# EAGLE design thick_ (EAGLE 9.6.2)
CNAME: Thicker PCB; CREVISION: 1; DESIGNER: Székely Flórián
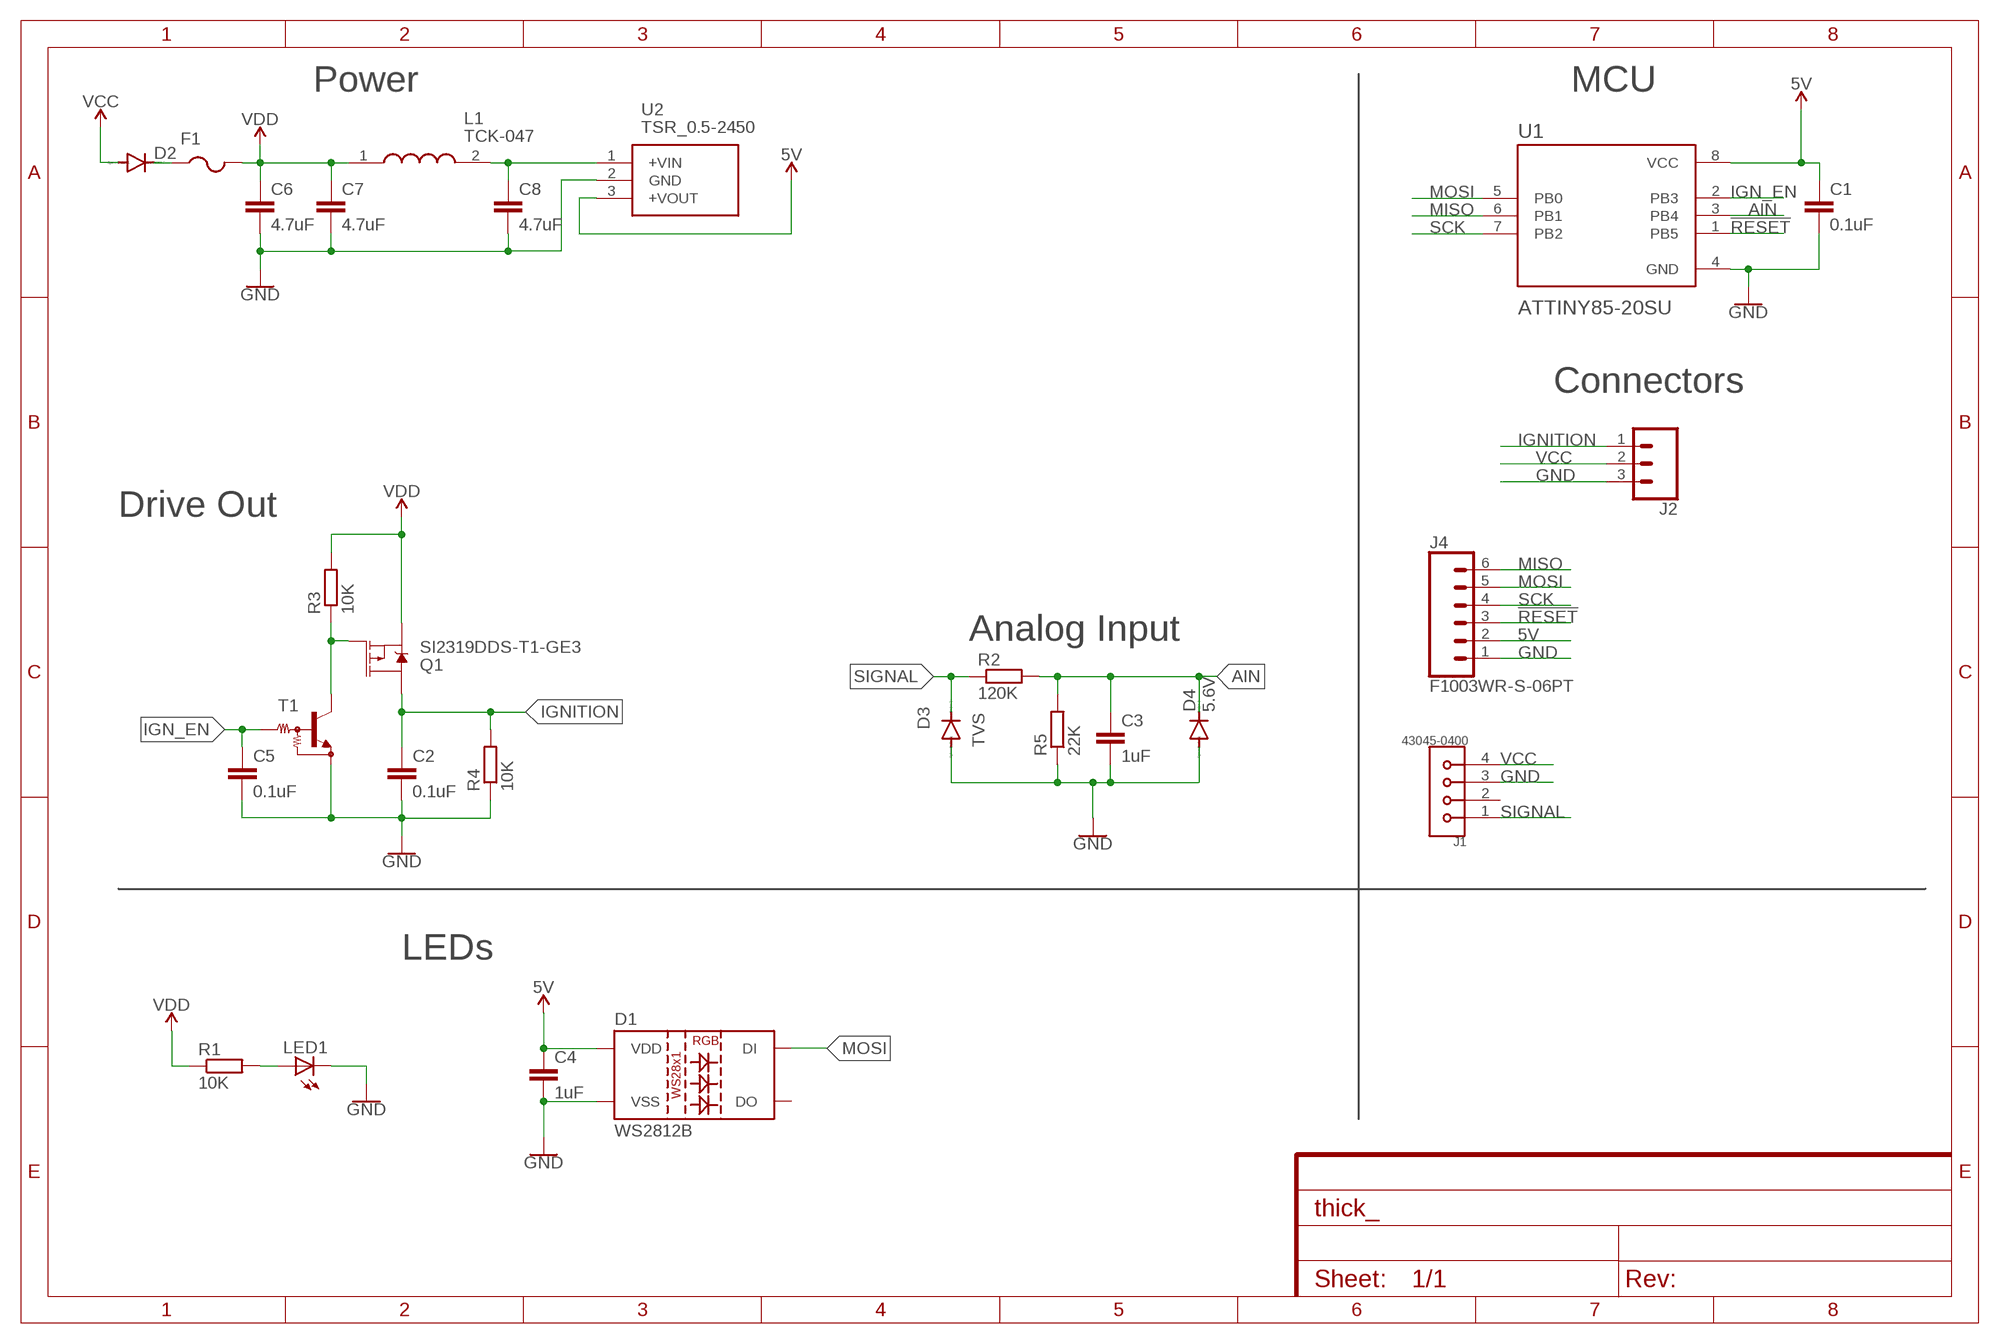
[diagram p0: schematic, sheet 1]

## Parts
C1  0.1uF  C-EUC0603  [C0603]
C2  0.1uF  C-EUC0603  [C0603]
C3  1uF  C-EUC0603  [C0603]
C4  1uF  C-EUC0603  [C0603]
C5  0.1uF  C-EUC0603  [C0603]
C6  4.7uF  C-EUC1206  [C1206]
C7  4.7uF  C-EUC1206  [C1206]
C8  4.7uF  C-EUC1206  [C1206]
D1  WS2812B  [WS2812B]
D2  DIODE-MINIMELF  [MINIMELF]
D3  TVS  DIODE-DO214AC  [DO214AC]
D4  5.6V  DIODE-MINIMELF  [MINIMELF]
F1  PTCFUSE-1206  [R1206]
J1  43045-0400  [MOLEX_43045-0400]
J2  CONN_03LONGPADS  [1X03_LONGPADS]
J4  F1003WR-S-06PT  [1X06-1MM]
L1  TCK-047  [TCK047]
LED1  LEDCHIPLED_0805  [CHIPLED_0805]
Q1  SI2319DDS-T1-GE3  MOSFET_PCH-DMG2307L  [SOT23-3]
R1  10K  R-EU_R0603  [R0603]
R2  120K  R-EU_R0603  [R0603]
R3  10K  R-EU_R0603  [R0603]
R4  10K  R-EU_R0603  [R0603]
R5  22K  R-EU_R0603  [R0603]
T1  MUN2213T1-NPN_DRIVER-SC59-BEC  [SC59-BEC]
U1  ATTINY85-20SU  [SOIC127P798X216-8N]
U2  TSR_0.5-2450  [TSR-0.5-2433]

## Nets
5V: C1.1 C4.1 D1.1(VDD) J4.2 U1.8(VCC) U2.3(+VOUT)
!RESET: J4.3 U1.1(PB5)
AIN: C3.1 D4.C R2.2 R5.2 U1.3(PB4)
GND: C1.2 C2.2 C3.2 C4.2 C5.2 C6.2 C7.2 C8.2 D1.3(VSS) D3.A D4.A J1.3 J2.3 J4.1 LED1.C R4.1 R5.1 T1.E U1.4(GND) U2.2(GND)
IGN_EN: C5.1 T1.B U1.2(PB3)
IGNITION: C2.1 J2.1 Q1.3(D) R4.2
MISO: J4.6 U1.6(PB1)
MOSI: D1.4(DI) J4.5 U1.5(PB0)
N$1: Q1.1(G) R3.1 T1.C
N$2: C8.1 L1.2 U2.1(+VIN)
N$3: LED1.A R1.2
N$11: D2.C F1.1
SCK: J4.4 U1.7(PB2)
SIGNAL: D3.C J1.1 R2.1
VCC: D2.A J1.4 J2.2
VDD: C6.1 C7.1 F1.2 L1.1 Q1.2(S) R1.1 R3.2
Unconnected: D1.2(DO) J1.2

## Notes on the sheet
- Power | MCU
- Connectors
- Drive Out
- Analog Input
- LEDs

## Library data of the parts
C1-C8 = resistor:C-EU: CAPACITOR, European symbol
D1 = SparkFun-LED:WS2812B: WS2812B SMD addressable RGB LED 5x5mm SMD LED with built-in controller IC. Color: Red/Green/Blue mC Rating: RGB: 390, 660, 180 mcd Forward Voltage: RGB: 2.0, 3.0, 3.0 V Packages:WS2812B SparkFun Products: Blynk Board - ESP8266 <https://www.sparkfun.com/products/13794>; PROD_ID: DIO-12503
D2-D4 = diode:DIODE-: DIODE
F1 = adafruit:PTCFUSE: PTC fuses, resettable thermistors
J1 = 43045-0400:43045-0400: Conn Micro-Fit 2x2 Way Header 3mm Pitch r/Angle Ti Check prices <https://pricing.snapeda.com/parts/43045-0400/Molex/view-part?ref=eda>; AVAILABILITY: Warning; DESCRIPTION: Connector Header Through Hole, Right Angle 4 position 0.118 (3.00mm); MF: Molex; MP: 43045-0400; PACKAGE: None; PRICE: None; PURCHASE-URL: https://pricing.snapeda.com/search/part/43045-0400/?ref=eda
J2 = SparkFun-Connectors:CONN_03: Multi connection point. Often used as Generic Header-pin footprint for 0.1 inch spaced/style header connections On any of the 0.1 inch spaced packages, you can populate with these: Break Away Headers - Straight <https://www.sparkfun.com/products/116> (PRT-00116) Break Away Male Headers - Right Angle <https://www.sparkfun.com/products/553> (PRT-00553) Female Headers <https://www.sparkfun.com/products/115> (PRT-00115) Break Away Headers - Machine Pin <https://www.sparkfun.com/products/117> (PRT-00117) Break Away Female Headers - Swiss Machine Pin <https://www.sparkfun.com/products/743> (PRT-00743) Stackable Header - 3 Pin (Female, 0.1") <https://www.sparkfun.com/products/13875> (PRT-13875) For SCREWTERMINALS and SPRING TERMINALS visit here: Screw Terimnals on SparkFun.com <https://www.sparkfun.com/search/results?term=Screw+Terminals> (5mm/3.5mm/2.54mm spacing) This device is also useful as a general connection point to wire up your design to another part of your project. Our various solder wires solder well into these plated through hole pads. Hook-Up Wire - Assortment (Stranded, 22 AWG) <https://www.sparkfun.com/products/11375> (PRT-11375) Hook-Up Wire - Assortment (Solid Core, 22 AWG) <https://www.sparkfun.com/products/11367> (PRT-11367) View the entire wire category on our website here <https://www.sparkfun.com/categories/141> Special notes: Molex polarized connector foot print use with SKU : PRT-08232 with associated crimp pins and housings.
J4 = FloManEagle:F1003WR-S-06PT
L1 = TCK-047:TCK-047: Common Mode Choke, 0.01mH,1.44A Source: Datasheet <https://www.tracopower.com/products/tck047.pdf>; DESCRIPTION: Common Mode Choke, 0.01mH,1.44A; HEIGHT: 5mm; MANUFACTURER_NAME: Traco Power; MANUFACTURER_PART_NUMBER: TCK-047; MOUSER_PART_NUMBER: 495-TCK-047; MOUSER_PRICE-STOCK: https://www.mouser.co.uk/ProductDetail/TRACO-Power/TCK-047?qs=ckJk83FOD0WGchnAom6PdQ%3D%3D
LED1 = adafruit:LED: LED OSRAM: - CHIPLED LG R971, LG N971, LY N971, LG Q971, LY Q971, LO R971, LY R971 LH N974, LH R974 LS Q976, LO Q976, LY Q976 LO Q996 - Hyper CHIPLED LW Q18S LB Q993, LB Q99A, LB R99A - SideLED LS A670, LO A670, LY A670, LG A670, LP A670 LB A673, LV A673, LT A673, LW A673 LH A674 LY A675 LS A676, LA A676, LO A676, LY A676, LW A676 LS A679, LY A679, LG A679 - Hyper Micro SIDELED® LS Y876, LA Y876, LO Y876, LY Y876 LT Y87S - SmartLED LW L88C, LW L88S LB L89C, LB L89S, LG L890 LS L89K, LO L89K, LY L89K LS L896, LA L896, LO L896, LY L896 - TOPLED LS T670, LO T670, LY T670, LG T670, LP T670 LSG T670, LSP T670, LSY T670, LOP T670, LYG T670 LG T671, LOG T671, LSG T671 LB T673, LV T673, LT T673, LW T673 LH T674 LS T676, LA T676, LO T676, LY T676, LB T676, LH T676, LSB T676, LW T676 LB T67C, LV T67C, LT T67C, LS T67K, LO T67K, LY T67K, LW E67C LS E67B, LA E67B, LO E67B, LY E67B, LB E67C, LV E67C, LT E67C LW T67C LS T679, LY T679, LG T679 LS T770, LO T770, LY T770, LG T770, LP T770 LB T773, LV T773, LT T773, LW T773 LH T774 LS E675, LA E675, LY E675, LS T675 LS T776, LA T776, LO T776, LY T776, LB T776 LHGB T686 LT T68C, LB T68C - Hyper Mini TOPLED® LB M676 - Mini TOPLED Santana® LG M470 LS M47K, LO M47K, LY M47K Source: http://www.osram.convergy.de/
Q1 = SparkFun-DiscreteSemi:MOSFET_PCH: P-channel MOSFETs Voltage controlled devices that allow control of high current outputs. SparkFun Products: SparkFun ESP32 Thing <https://www.sparkfun.com/products/13907> SparkFun ESP8266 Thing <https://www.sparkfun.com/products/13231>; PROD_ID: TRANS-11308; VALUE: 2.5A/30V/105mΩ
R1-R5 = resistor:R-EU_: RESISTOR, European symbol
T1 = transistor:*-NPN_DRIVER-: NPN Bias Resistor Transistor
U1 = ATTINY85-20SU:ATTINY85-20SU: AVR AVR® ATtiny, Functional Safety (FuSa) Microcontroller IC 8-Bit 20MHz 8KB (4K x 16) FLASH 8-SOIC Check prices <https://pricing.snapeda.com/parts/ATTINY85-20SU/Microchip%20Technology/view-part?ref=eda>; AVAILABILITY: Warning; DESCRIPTION: AVR AVR® ATtiny, Functional Safety (FuSa) Microcontroller IC 8-Bit 20MHz 8KB (4K x 16) FLASH 8-SOIC; MF: Microchip Technology; MP: ATTINY85-20SU; PACKAGE: SOIC-8 Microchip; PRICE: None; PURCHASE-URL: https://pricing.snapeda.com/search/part/ATTINY85-20SU/?ref=eda
U2 = TSR_0.5-2450:TSR_0.5-2450: 0.5 Amp POL switching regulator, 4.75 to -32 VDC input, pos.-pos. circuit, LM78 compatible, SIP-3 Source: Datasheet <https://tracopower.com/tsr0-5-datasheet/>; DESCRIPTION: 0.5 Amp POL switching regulator, 4.75 to -32 VDC input, pos.-pos. circuit, LM78 compatible, SIP-3; HEIGHT: mm; MANUFACTURER_NAME: Traco Power; MANUFACTURER_PART_NUMBER: TSR 0.5-2450; MOUSER_PART_NUMBER: 495-TSR0.5-2450; MOUSER_PRICE-STOCK: https://www.mouser.co.uk/ProductDetail/TRACO-Power/TSR-05-2450?qs=ckJk83FOD0XpEgQBSwF%2FIw%3D%3D

## Board
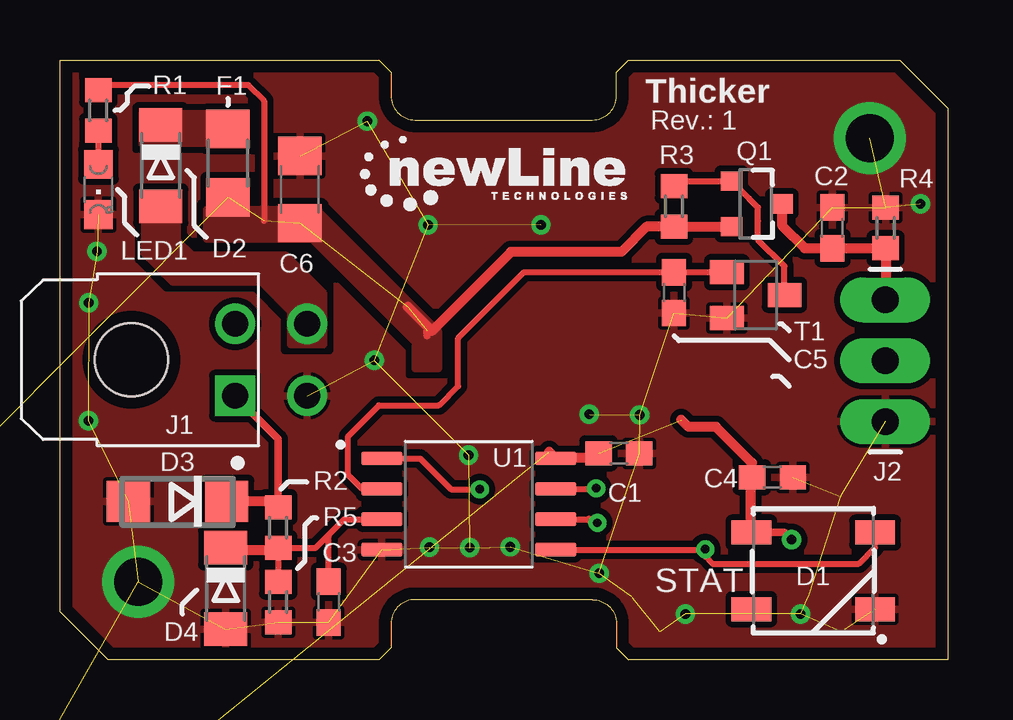
[diagram p1: board, top side]
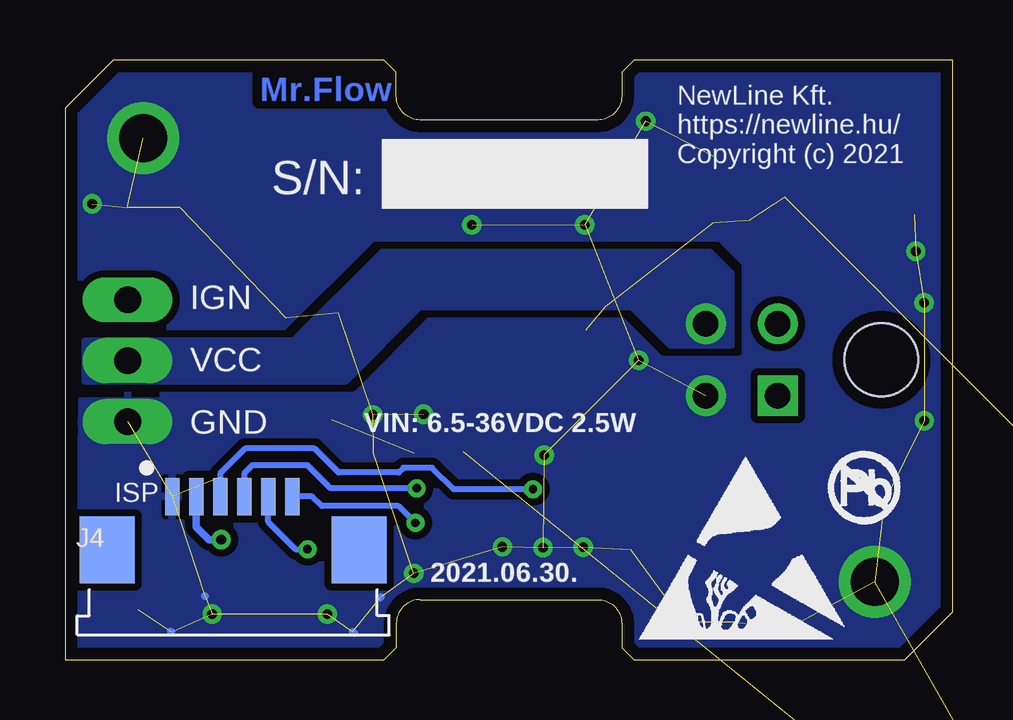
[diagram p2: board, bottom side, seen from below]

Size 37 x 25 mm. Coordinates in mm from the lower left corner, seen from the top.
Outline: 13.8,24.5 13.8,23.5 arc90 14.8,22.5 22.2,22.5 arc90 23.2,23.5 23.2,24.5 23.7,25 35,25 37,23 37,0 23.7,0 23.2,0.5 23.2,1.5 arc90 22.2,2.5 14.8,2.5 arc90 13.8,1.5 13.8,0.5 13.3,0 2,0 0,2 0,25 13.3,25 13.8,24.5
Copper layers (1*16): Top 0.035mm / dielectric 1.5mm / Bottom 0.035mm
Design rules "NYAKARUHAZ *": minimum track width 6mil, minimum drill 12mil, track to track 10mil, track to pad 10mil, pad to pad 10mil, via to via 10mil, smd to smd 6mil, copper to edge 20mil, drill to drill 8mil, minimum pad ring 10mil, minimum via ring 8mil, stop-mask expansion 4mil, vias tented up to drill 16mil, thermal gap 6mil

### Footprints (pad centres in the part's own frame; a part is rotated, then mirrored left to right if it is on the bottom)
C0603 = smd 1.1 x 1: 1 -0.85,0; 2 0.85,0
C1206 = smd 1.6 x 1.8: 1 -1.4,0; 2 1.4,0
WS2812B = smd 1.651 x 1: 1 2.577,-1.6; 2 2.577,1.6; 3 -2.577,1.6; 4 -2.577,-1.6
MINIMELF = smd 1.4 x 1.8: A 1.7,0; C -1.7,0
DO214AC = smd 1.8 x 1.7: A 2.05,0; C -2.05,0
R1206 = smd 1.6 x 1.803: 1 -1.422,0; 2 1.422,0
MOLEX_43045-0400 = drill 1.07 pad 1.67 square: 1 1.5,2.8 | drill 1.07 pad 1.67: 2 -1.5,2.8; 3 1.5,5.8; 4 -1.5,5.8 | hole 3.05: 0,-1.52
1X03_LONGPADS = drill 1.118 pad 1.88 long: 1 0,0; 2 2.54,0; 3 5.08,0
1X06-1MM = smd 0.6 x 1.55: 1 -2.54,1.27; 2 -1.54,1.27; 3 -0.54,1.27; 4 0.46,1.27; 5 1.46,1.27; 6 2.46,1.27 | smd 2.3 x 2.8: P$1 -5.25,-0.955; P$2 5.25,-0.955
TCK047 = smd 5.5 x 2.15: 1 0,1.925; 2 0,-1.925
CHIPLED_0805 = smd 1.2 x 1.2: A 0,-1.05; C 0,1.05
SOT23-3 = smd 0.8 x 0.9: 1 -0.95,-1; 2 0.95,-1; 3 0,1.1
R0603 = smd 1 x 1.1: 1 -0.85,0; 2 0.85,0
SC59-BEC = smd 1 x 1.4: B -0.95,-1.2; C 0,1.2; E 0.95,-1.2
SOIC127P798X216-8N = smd 1.71 x 0.58: 1 -3.63,1.905; 2 -3.63,0.635; 3 -3.63,-0.635; 4 -3.63,-1.905; 5 3.63,-1.905; 6 3.63,-0.635; 7 3.63,0.635; 8 3.63,1.905
TSR-0.5-2433 = drill 0.94 pad 1.44: 1 3.21,2; 2 5.75,2; 3 8.29,2

### Placement (x,y rotation side)
C1  23.3,8.6 0 top
C2  32.2,18 90 top
C3  11.2,2.4 270 top
C4  29.7,7.6 0 top
C5  25.6,15.3 270 top
C6  10,19.6 90 top
C7  -13.1,-14.9 0 top  (outside the outline)
C8  -13.1,-21.1 0 top  (outside the outline)
D1  31.4,3.7 180 top
D2  4.2,20.6 270 top
D3  4.9,6.6 180 top
D4  6.91,2.96 270 top
F1  7,20.7 270 top
J1  4.5,12.5 270 top
J2  34.4,15 270 top
J4  30,5.52 0 bottom
L1  -9.2,1.1 0 top  (outside the outline)
LED1  1.6,19.6 180 top
Q1  29,19 270 top
R1  1.6,22.9 270 top
R2  9.1,5.5 270 top
R3  25.6,18.9 270 top
R4  34.42,18 270 top
R5  9.1,2.4 90 top
T1  29,15.2 270 top
U1  17.04,6.48 0 top
U2  -9.3,-10.7 0 top  (outside the outline)
U$1  [ESD_LOGO]  13.4,0.2 0 bottom
U$2  [NO_PB_LOGO_0.120]  5.41,5.27 0 bottom

### Tracks (layer width: path | path; a pad name or v marks a point on that pad's centre or on a via)
5V  (via drill 0.4)  (2 unrouted)
  Top 0.254: C4.1 28.8,7.65 28.8,7.7
  Top 0.305: D1.1 30.2,5.3 v30.5,5
  Top 0.406: 28.85,5.33 D1.1 | D1.1 28.82,5.58 | D1.1 28.8,5.32 28.8,7.7 | C4.1 28.85,8.2 27.35,9.7 26.2,9.7 25.9,10 | 20.39,8.66 U1.8 20.68,8.4 22.25,8.4 C1.1
  Bottom 0.305: v30.5,5 31,5 31.54,5.54 J4.2
!RESET  (via drill 0.35)
  Top 0.254: U1.1 15.02,8.38 16.3,7.1 v17.5,7.1
  Bottom 0.254: v17.5,7.1 20.8,7.1 21.7,8 22.9,8 23.1,7.8 25.6,7.8 26.6,8.8 29.5,8.8 30.54,7.76 J4.3
AIN
  Top 0.254: R5.2 R2.2 10.65,4.65 11.15,5.15 | C3.1 11.2,5.15 11.15,5.15 | U1.3 11.85,5.84 11.15,5.15
  Top 0.406: D4.C 7.02,4.55 9,4.55 R2.2
GND  (via drill 0.4, 2)  (42 unrouted)
  Bottom 0.305: 32.56,1.15 32.6,1.18 | 31.19,2.67 31.17,2.65 | 23.88,2.57 23.84,2.61 | 24.94,1.09 25.01,1.16
  other vias: 3.25,3.25 33.75,21.75 17.08,4.66 12.81,22.45 15.34,18.13 18.77,4.7 20.05,18.12 1.2,14.87 17.03,8.53 15.41,4.68 1.19,9.96 22.07,10.22 35.87,19 26.07,1.9 30.87,1.9 13.1,12.47 22.47,3.6 1.54,17.03 24.17,10.2
  pour Top (isolate 0.254, rank 6): -2.6,26.6 39.7,26.6 39.7,-2.6 -2.6,-2.6
  pour Bottom (isolate 0.305, rank 6): -5.1,26.9 40.5,26.9 40.5,-2.8 -5.1,-2.8
  pour Bottom (no thermals): 36.4,10.8 36.4,8.6 32.4,8.6 32.4,10.8
  pour Bottom (no thermals): 11.3,11.9 9.4,11.9 9.4,10.4 9.4,10 10.3,10 11.3,10
IGN_EN
  Top 0.254: U1.2 12.59,7.12 12,7.7 12,9.3 13.3,10.6 15.8,10.6 16.6,11.4 16.6,13.4 19.35,16.15 C5.1 T1.B
IGNITION
  Top 0.406: Q1.3 30.1,18.1 31.05,17.15 C2.1 R4.2 34.42,15.02 J2.1
MISO  (via drill 0.35)
  Top 0.254: U1.6 22.05,5.84
  Top 0.305: v22.4,5.7 22.2,5.7 22.05,5.84
  Bottom 0.254: v22.4,5.7 23.1,6.4 26.3,6.4 26.7,6.8 J4.6
MOSI  (via drill 0.35)
  Top 0.254: D1.4 33.98,4.68 33.3,4 27.2,4 26.9,4.3 v26.9,4.6 26.9,4.58 U1.5
  Bottom 0.254: v26.9,4.6 27.4,4.6 28.54,5.74 J4.5
N$1
  Top 0.254: R3.1 25.8,19.95 Q1.1 28.73,19.23 29.1,18.85 29.1,18.3 29.1,17.5 30.2,16.4 T1.C
N$2  (2 unrouted)
N$3
  Top 0.254: R1.2 LED1.A
N$11
  pour Top (no thermals): 3.4,22.8 7.7,22.8 7.7,21.5 3.4,21.5
SCK  (via drill 0.35)
  Top 0.254: U1.7 22.33,7.12 v22.35,7.14
  Bottom 0.254: v22.35,7.14 25.94,7.14 26.9,8.1 29.2,8.1 29.54,7.76 J4.4
SIGNAL
  Top 0.305: J1.1 9.1,9.2 R2.1
  Top 0.406: R2.1 8.85,6.6 D3.C
VCC
  pour Bottom (no thermals): 36.2,11.6 25.3,11.6 22.2,14.7 13.4,14.7 11.8,13.1 9.2,13.1 9.2,16.1 10.1,17 23.8,17 27.5,13.3 36.2,13.3
  pour Top (no thermals): 9.6,13.1 9.6,14.5 8.4,15.7 4.7,15.7 3.5,16.9 3.5,19.4 4.9,19.4 4.9,17.5 5.5,16.9 9.4,16.9 11,15.3 11,13.1
VDD  (6 unrouted)
  Top 0.254: R1.1 1.9,23.75 2.1,23.95 7.85,23.95 8.5,23.3 8.5,18.3
  Top 0.305: 15.31,13.71 15.31,13.51
  Top 0.406: Q1.2 R3.2 24.45,18.05 23.4,17 18.8,17 15.5,13.7 14.5,14.7
  pour Top (no thermals): 6.1,18.8 10.8,18.8 10.8,17.5 6.1,17.5
  pour Top (no thermals): 9.3,17.6 9.3,18.7 10.1,18.7
  pour Top (no thermals): 14.8,12.1 14.8,13.2 10.4,17.6 10.2,17.6 10.2,18.8 10.7,18.8 15.8,13.7 15.8,12.1

### Text on the board
Bottom: Mr.Flow
tPlace: Thicker | Rev.: 1 | STAT | /Users/szekelyflorian/Downloads/logo.bmp
bPlace: NewLine Kft. / https://newline.hu/ / Copyright (c) 2021 | S/N: | IGN | VCC | VIN: 6.5-36VDC 2.5W | GND | ISP | 2021.06.30.